# Altium schematic sheet PowerOldCaps.SchDoc
size A; SheetNumber: 1; SheetTotal: 1
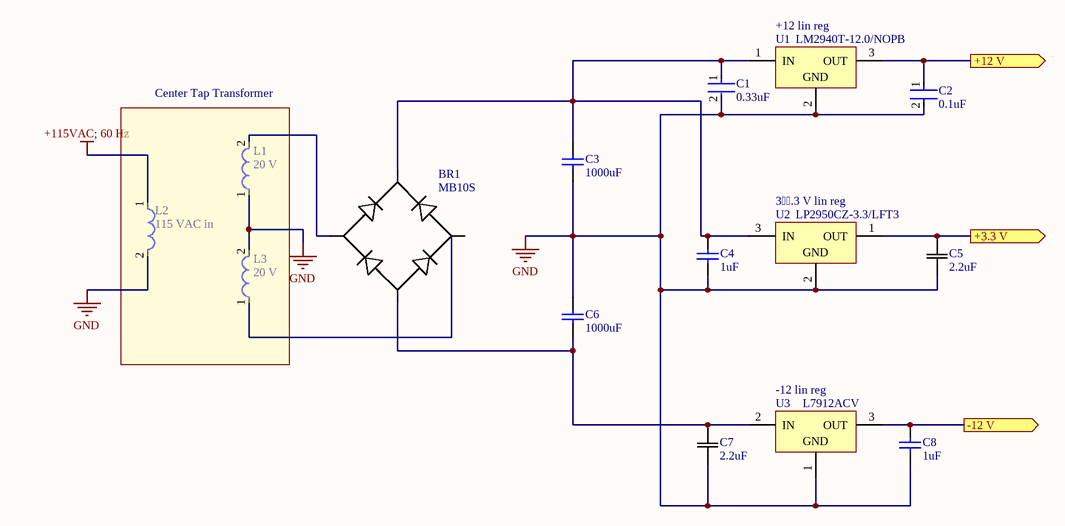
[diagram p0: PowerOldCaps.SchDoc]

## Parts
BR1  MB10S  [HDS_DIO]
C1  0.33uF  [FP-C0603C-CF-MFG]
C2  0.1uF  [FP-C0603C-CF-MFG]
C3  1000uF  [CAPC3216X110X50LL20T25]
C4  1uF  [CAPC3216X110X50LL20T25]
C5  2.2uF  [CAPC340180_180N_KEM]
C6  1000uF  [CAPC3216X110X50LL20T25]
C7  2.2uF  [CAPC340180_180N_KEM]
C8  1uF  [CAPC3216X110X50LL20T25]
L1  20 V  [FP-LQH55DN_03-MFG]
L2  115 VAC in  [FP-LQH55DN_03-MFG]
L3  20 V  [FP-LQH55DN_03-MFG]
U1  LM2940T-12.0/NOPB  [NDE0003A]
U2  LP2950CZ-3.3/LFT3  [LP0003A]
U3  L7912ACV  [TO220]

## Blocks framed on the sheet
Center Tap Transformer: L1-L3

## Ports
+3.3 V (out), +12 V (out), -12 V (out)

## Nets
+115VAC; 60 Hz: L2.1
GND: C1.2 C2.2 C3.1 C4.1 C5.1 C6.2 C7.1 C8.1 L1.1 L2.2 L3.2 U1.2(GND) U2.2(GND) U3.1(GND)
+3.3 V: C5.2 U2.1(OUT) ; port +3.3 V
+12 V: C2.1 U1.3(OUT) ; port +12 V
-12 V: C8.2 U3.3(OUT) ; port -12 V
NetBR1_1: BR1.1 C1.1 C3.2 C4.2 U1.1(IN) U2.3(IN)
NetBR1_2: BR1.2 L1.2
NetBR1_3: BR1.3 C6.1 C7.2 U3.2(IN)

Not connected (* = marked no-connect by the designer): BR1 4; L3 1

## Notes on the sheet
- (near U1) +12 lin reg
- (near U2) 3.3 V lin reg
- (near U3) -12 lin reg

## Library data of the parts
BR1 = HDS10M-13: No Description Available; Mfr_Name: Diodes Inc; Copyright: Copyright (C) 2021 Ultra Librarian. All rights reserved.; Manufacturer_Part_Number: HDS10M-13; RefDes: RefDes; Type: DEV
C1 = CMP-2006-03790-2: Cap Ceramic 0.33uF 16V X7R 10% SMD 0603 125°C Punched Paper T/R; Manufacturer Part Number: C0603C334K4RACAUTO; Manufacturer: KEMET; Temperature Coefficient: 30ppm/°C; Tolerance: 0.1; Value: 0.33 μF; Automotive Grade: Grade 1; Height: 0.87mm; Automotive: Yes; Temperature Characteristic: X7R; Voltage Rating: 16 V; Temperature Range High: +125°C; Mouser Description: Cap Ceramic 0.33uF 16V X7R 10% SMD 0603 125°C Punched Paper T/R; Material: Ceramic; ComponentLink2Description: Datasheet; RoHS: TRUE; Lead Free: Yes; Device Class L1: Passive Components; Capacitance: 0.33 μF; Category: Cap; Temperature Range Low: -55°C; Device Class L3: Ceramic Capacitors; Octopart: https://octopart.com/c0603c334k4racauto-kemet-22884303; Temperature: -55°C to +125°C; Digikey Description: Cap Ceramic 0.33uF 16V X7R 10% SMD 0603 125°C Punched Paper T/R; ComponentLink2URL: https://api.kemet.com/component-edge/download/datasheet/C0603C100J5GACAUTO.pdf; Device Class L2: Capacitors; Package: C0603C-CF
C2 = CMP-2006-03061-2: CAP CER 0.1UF 50V X7R 0603; Manufacturer: KEMET; Manufacturer Part Number: C0603C104K5RACTU; Tolerance: 0.1; Temperature Coefficient: 30ppm/°C; Material: Ceramic; Automotive Grade: Grade 1; Value: 0.10 μF; Temperature: -55°C to +125°C; RoHS: TRUE; Temperature Range High: +125°C; Lead Free: Yes; Octopart: https://octopart.com/c0603c104k5ractu-kemet-139244; Digikey Description: CAP CER 0.1UF 50V X7R 0603; Category: Cap; Package: C0603C-CF; ComponentLink2Description: Datasheet; Temperature Range Low: -55°C; Device Class L1: Passive Components; Voltage Rating: 50 V; Automotive: Yes; Device Class L3: Ceramic Capacitors; ComponentLink2URL: https://api.kemet.com/component-edge/download/datasheet/C0603C100J5GACAUTO.pdf; Capacitance: 0.10 μF; Device Class L2: Capacitors; Temperature Characteristic: X7R; Height: 0.87mm
C3 C6 = CMP-2000-06011-1: Chip Capacitor, 1 uF, +/- 10%, 50 V, -55 to 125 degC, 1206 (3216 Metric), RoHS, Tape and Reel; Manufacturer: Kemet; Case Height: 1mm; Dielectric: X7R; Voltage Rating: 50V; Capacitance: 1uF; Temperature Coefficient / Code: +/-15%; Case Length: 3.2mm; Case Width: 1.6mm; Type: SMDMLCCX7R6.3-250VDCCommericalGrade; Class: Class1; Capacitance - nF: 1000nF; Datasheet URL: http://www.kemet.com/docfinder?Partnumber=C1206C105K5RACTU; Product Category: MultilayerCeramicCapacitorsMLCC-SMD/SMT; Termination Style: SMD/SMT; Dimensions: 1.6mmWx3.2mmLx1mmH; Voltage Rating DC: 50V; Datasheet Version: 02/2016; Packaging: Reel; Brand: Kemet; RoHS: Details; Minimum Operating Temperature: -55C; Operating Temperature Range: -55Cto+125C; Package Reference: 1206; Manufacturer URL: http://www.kemet.com/; Product: GeneralTypeMLCCs; Tolerance: 10%; Package Description: 2-Pin Surface Mount Device, Body 3.2 x 1.6 mm; Mounting Technology: SurfaceMount; Case Code - mm: 3216; Maximum Operating Temperature: +125C; Series: C1206C; Factory Pack Quantity: 2500; Package / Case: 1206(3216metric); Case Code - in: 1206
C4 C8 = CMP-2000-06011-1: Chip Capacitor, 1 uF, +/- 10%, 50 V, -55 to 125 degC, 1206 (3216 Metric), RoHS, Tape and Reel; Manufacturer: Kemet; Case Height: 1mm; Dielectric: X7R; Voltage Rating: 50V; Temperature Coefficient / Code: +/-15%; Case Length: 3.2mm; Case Width: 1.6mm; Type: SMDMLCCX7R6.3-250VDCCommericalGrade; Class: Class1; Capacitance - nF: 1000nF; Datasheet URL: http://www.kemet.com/docfinder?Partnumber=C1206C105K5RACTU; Product Category: MultilayerCeramicCapacitorsMLCC-SMD/SMT; Capacitance: 1uF; Termination Style: SMD/SMT; Dimensions: 1.6mmWx3.2mmLx1mmH; Voltage Rating DC: 50V; Datasheet Version: 02/2016; Packaging: Reel; Brand: Kemet; RoHS: Details; Minimum Operating Temperature: -55C; Operating Temperature Range: -55Cto+125C; Package Reference: 1206; Manufacturer URL: http://www.kemet.com/; Product: GeneralTypeMLCCs; Tolerance: 10%; Package Description: 2-Pin Surface Mount Device, Body 3.2 x 1.6 mm; Mounting Technology: SurfaceMount; Case Code - mm: 3216; Maximum Operating Temperature: +125C; Series: C1206C; Factory Pack Quantity: 2500; Package / Case: 1206(3216metric); Case Code - in: 1206
C5 C7 = C1206C225K5RACTU: 2.2uF Ceramic cap; Mfr_Name: Kemet; Type: DEV; Copyright: Copyright (C) 2021 Ultra Librarian. All rights reserved.; Manufacturer_Part_Number: C1206C225K5RACTU; Digi-Key_Part_Number_1: 399-8181-1-ND; Digi-Key_Part_Number_2: 399-8181-2-ND; Digi-Key_Part_Number_3: 399-8181-6-ND; RefDes: RefDes
L1-L3 = CMP-06042-002541-1: Wire Wound Ferrite Inductor for Power Lines 220μH ±20% 3.36Ω  0.32A 2220; Shielding: Unshielded; Current Rating: 320mA; Series Resistance: 2.4R; Inductance: 220uH; Self Resonant Frequency: 4MHz; Test Frequency: 100kHz; Weight: 0.016932oz; Case Code (Imperial): 2220; Width: 0.197inch; Radiation Hardening: No; Tolerance: 20%; Military Standard: Not; Case Code (Metric): 5750; Height - Seated (Max): 0.198inch; Depth: 5.3mm; Min Operating Temperature: -40°C; Lead Free: Lead Free; Case/Package: 2220; Length: 5.7mm; Max DC Current: 320mA; Termination: SMD/SMT; Height: 4.7mm; Package Quantity: 350; Packaging: Tape and Reel; Mount: Surface Mount; DC Current: 320mA; REACH SVHC: No SVHC; Resistor Type: Wirewound; Max Operating Temperature: 80°C; DC Resistance (DCR): 2.4R; Inductance Tolerance: 20%; Core Material: Ferrite
U1 = CMP-0062-02521-3: 1A Low Dropout Regulator, 3-pin TO-220, Pb-Free; Manufacturer: Texas Instruments; PowerWise: N; CompType: LDO IC; PackageTopMarking: NSUZXYTTE#*LM2940T*12.0 P+; PackageDescription: TO-220, Molded, 3 Lead, Straight; PinCount: 3; RoHS: Y; PackageReference: NDE0003A; ComponentLink1URL: http://www.ti.com/general/docs/lit/getliterature.tsp?genericPartNumber=LM2940-N&fileType=pdf; ComponentLink1Description: Datasheet URL
U2 = CMP-0062-00052-3: Series of Adjustable Micropower Voltage Regulators, 3-pin TO-92, Pb-Free; Manufacturer: Texas Instruments; CompType: LDO IC; PowerWise: N; PackageTopMarking: NSXYTT*2950*CZ3.3; Code_JEDEC: TO-226-AA; PinCount: 3; RoHS: Y; ComponentLink1Description: Datasheet URL; PackageDescription: TO-92, Molded, 3 Lead; ComponentLink1URL: http://www.ti.com/general/docs/lit/getliterature.tsp?genericPartNumber=LP2950-N&fileType=pdf; PackageReference: LP0003A
U3 = CMP-0244-00427-1: 2% Negative Voltage Regulator, -12V, 3-Pin TO-220; ComponentLink2Description: Datasheet; PackageReference: TO220; ComponentLink1Description: Manufacturer URL; DatasheetVersion: 1/11/2010; ComponentLink2URL: http://www.st.com/internet/com/TECHNICAL_RESOURCES/TECHNICAL_LITERATURE/DATASHEET/CD00000451.pdf; PackageVersion: ver3.0; ComponentLink3Description: Package Specification; PackageDescription: TO, Thru-Hole, Vertical, Heatsink Mounted; 3 In-Line Leads; Pitch 2.54 mm; ComponentLink3URL: http://www.st.com/internet/com/TECHNICAL_RESOURCES/TECHNICAL_LITERATURE/PACKAGE_INFORMATION/CD00004649.pdf; ComponentLink1URL: http://www.st.com